# Altium schematic sheet Boost_Conv_V1.0_Control_Sch.SchDoc
size A; SheetNumber: 2; SheetTotal: 3
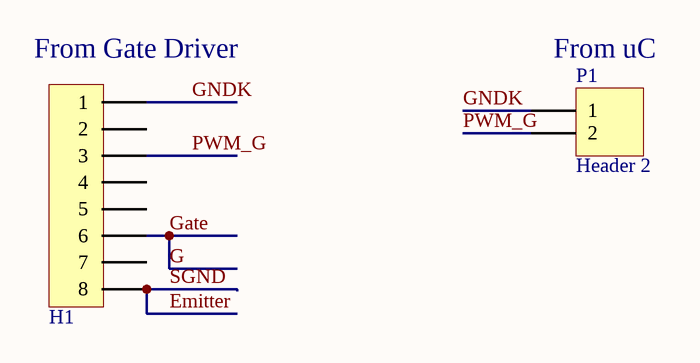
[diagram p0: Boost_Conv_V1.0_Control_Sch.SchDoc]

## Parts
H1  H2*8  [HDR2X8]  (value not drawn)
P1  Header 2  [HDR1X2]

## Nets
Emitter: H1.8  [also labelled SGND]
G: H1.6  [also labelled Gate]
GNDK: H1.1 P1.1
PWM_G: H1.3 P1.2

Not connected (* = marked no-connect by the designer): H1 2 4 5 7

## Notes on the sheet
- (near H1) From Gate Driver
- (near P1) From uC

## Library data of the parts
H1 = Header 8X2
P1 = Header 2: Header, 2-Pin; LatestRevisionDate: 17-Jul-2002; LatestRevisionNote: Re-released for DXP Platform.; Publisher: Altium Limited